# Altium schematic sheet Sheet6.SchDoc
size B
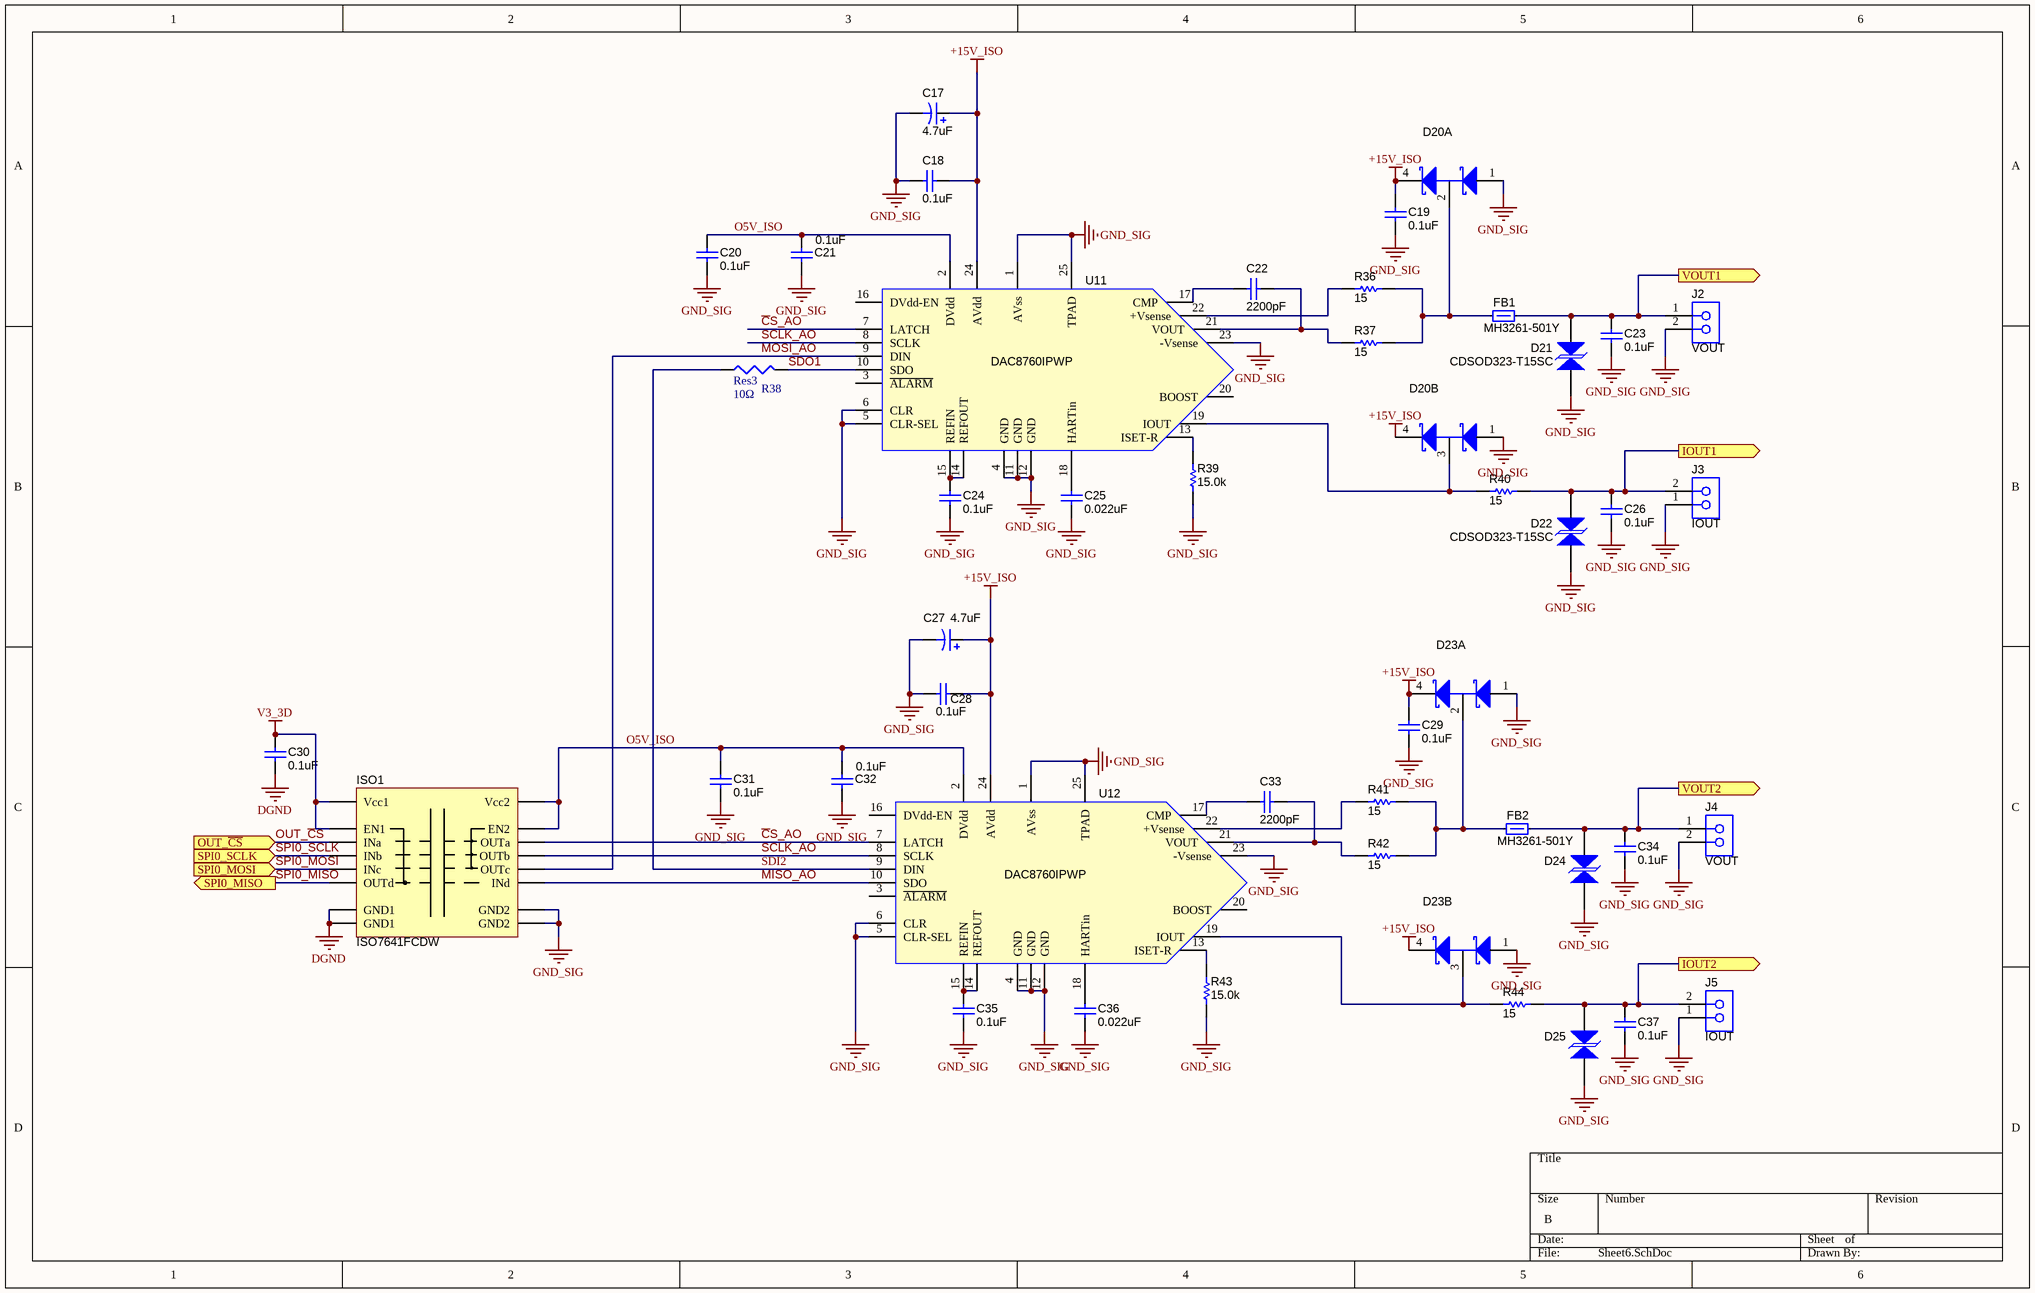
[diagram p0: Sheet6.SchDoc]

## Parts
C17  ValueDisplayed: 4.7uF  [6032-28]  (hidden comment: 293D475X9035C2TE3)
C18  ValueDisplayed: 0.1uF  [0805_cap]  (hidden comment: GRM188R71H104KA93D)
C19  ValueDisplayed: 0.1uF  [0805_cap]  (hidden comment: GRM188R71H104KA93D)
C20  ValueDisplayed: 0.1uF  [0805_cap]  (hidden comment: GRM188R71H104KA93D)
C21  ValueDisplayed: 0.1uF  [0805_cap]  (hidden comment: GRM188R71H104KA93D)
C22  ValueDisplayed: 2200pF  [0805_cap]  (hidden comment: GRM1885C1H222JA01D)
C23  ValueDisplayed: 0.1uF  [0805_cap]  (hidden comment: 06035C104KAT2A)
C24  ValueDisplayed: 0.1uF  [0805_cap]  (hidden comment: 06035C104KAT2A)
C25  ValueDisplayed: 0.022uF  [0805_cap]  (hidden comment: C1608X7R1H223K)
C26  ValueDisplayed: 0.1uF  [0805_cap]  (hidden comment: 06035C104KAT2A)
C27  ValueDisplayed: 4.7uF  [6032-28]  (hidden comment: 293D475X9035C2TE3)
C28  ValueDisplayed: 0.1uF  [0805_cap]  (hidden comment: GRM188R71H104KA93D)
C29  ValueDisplayed: 0.1uF  [0805_cap]  (hidden comment: GRM188R71H104KA93D)
C30  ValueDisplayed: 0.1uF  [0805_cap]  (hidden comment: GRM188R71H104KA93D)
C31  ValueDisplayed: 0.1uF  [0805_cap]  (hidden comment: GRM188R71H104KA93D)
C32  ValueDisplayed: 0.1uF  [0805_cap]  (hidden comment: GRM188R71H104KA93D)
C33  ValueDisplayed: 2200pF  [0805_cap]  (hidden comment: GRM1885C1H222JA01D)
C34  ValueDisplayed: 0.1uF  [0805_cap]  (hidden comment: 06035C104KAT2A)
C35  ValueDisplayed: 0.1uF  [0805_cap]  (hidden comment: 06035C104KAT2A)
C36  ValueDisplayed: 0.022uF  [0805_cap]  (hidden comment: C1608X7R1H223K)
C37  ValueDisplayed: 0.1uF  [0805_cap]  (hidden comment: 06035C104KAT2A)
D20  (no value)  [SOT-143]  (parts A,B of 2)
D21  CDSOD323-T15SC  [sod-323]
D22  CDSOD323-T15SC  [sod-323]
D23  (no value)  [SOT-143]  (parts A,B of 2)
D24  (no value)  [sod-323]
D25  (no value)  [sod-323]
FB1  MH3261-501Y  [1210]
FB2  MH3261-501Y  [1210]
ISO1  ISO7641FCDW  [M16B_N]
J2  VOUT  [ED555/2DS]
J3  IOUT  [ED555/2DS]
J4  VOUT  [ED555/2DS]
J5  IOUT  [ED555/2DS]
R36  value 15  [0805]  (hidden comment: CRCW060315R0JNEA)
R37  value 15  [0805]  (hidden comment: CRCW060315R0JNEA)
R38  Res3  value 10Ω  [0805]
R39  value 15.0k  [0805]  (hidden comment: RT0603BRD0715KL)
R40  value 15  [1210]  (hidden comment: RPC2512JT15R0)
R41  value 15  [0805]  (hidden comment: CRCW060315R0JNEA)
R42  value 15  [0805]  (hidden comment: CRCW060315R0JNEA)
R43  value 15.0k  [0805]  (hidden comment: RT0603BRD0715KL)
R44  value 15  [1210]  (hidden comment: RPC2512JT15R0)
U11  DAC8760IPWP  [PWP24-DIE84X166]
U12  DAC8760IPWP  [PWP24-DIE84X166]

## Ports
IOUT1 (out), IOUT2 (out), OUT_~{CS} (in), SPI0_MISO (out), SPI0_MOSI (in), SPI0_SCLK (in), VOUT1 (out), VOUT2 (out)

## Nets
+15V_ISO: C17.1(+) C18.1 C19.1 C27.1(+) C28.1 C29.1 D20.4 D23.4 U11.24(AVdd) U12.24(AVdd)
DGND: C30.2 ISO1.2(GND1) ISO1.8(GND1)
GND_SIG: C17.2(-) C18.2 C19.2 C20.2 C21.2 C23.2 C24.2 C25.2 C26.2 C27.2(-) C28.2 C29.2 C31.2 C32.2 C34.2 C35.2 C36.2 C37.2 D20.1 D21.2 D22.2 D23.1 D24.2 D25.2 ISO1.9(GND2) ISO1.15(GND2) J2.2 J3.1 J4.2 J5.1 R39.1 R43.1 U11.1(AVss) U11.4(GND) U11.5(CLR-SEL) U11.6(CLR) U11.11(GND) U11.12(GND) U11.23(-Vsense) U11.25(TPAD) U12.1(AVss) U12.4(GND) U12.5(CLR-SEL) U12.6(CLR) U12.11(GND) U12.12(GND) U12.23(-Vsense) U12.25(TPAD)
V3_3D: C30.1 ISO1.1(Vcc1) ISO1.7(EN1)
~{C}S_AO: ISO1.14(OUTa) U11.7(LATCH) U12.7(LATCH)
IOUT1: C26.1 D22.1 J3.2 R40.2 ; port IOUT1
IOUT2: C37.1 D25.1 J5.2 R44.2 ; port IOUT2
MISO_AO: ISO1.11(INd) U12.10(SDO)
MOSI_AO: ISO1.12(OUTc) U11.9(DIN)
O5V_ISO: C20.1 C21.1 C31.1 C32.1 ISO1.10(EN2) ISO1.16(Vcc2) U11.2(DVdd) U12.2(DVdd)
OUT_~{CS}: ISO1.3(INa) ; port OUT_~{CS}
SCLK_AO: ISO1.13(OUTb) U11.8(SCLK) U12.8(SCLK)
SDI2: R38.1 U12.9(DIN)
SDO1: R38.2 U11.10(SDO)
SPI0_MISO: ISO1.6(OUTd) ; port SPI0_MISO
SPI0_MOSI: ISO1.5(INc) ; port SPI0_MOSI
SPI0_SCLK: ISO1.4(INb) ; port SPI0_SCLK
VOUT1: C23.1 D21.1 FB1.2 J2.1 ; port VOUT1
VOUT2: C34.1 D24.1 FB2.2 J4.1 ; port VOUT2
NetC22_1: C22.1 R37.1 U11.21(VOUT)
NetC22_2: C22.2 U11.17(CMP)
NetC24_1: C24.1 U11.14(REFOUT) U11.15(REFIN)
NetC25_1: C25.1 U11.18(HARTin)
NetC33_1: C33.1 R42.1 U12.21(VOUT)
NetC33_2: C33.2 U12.17(CMP)
NetC35_1: C35.1 U12.14(REFOUT) U12.15(REFIN)
NetC36_1: C36.1 U12.18(HARTin)
NetD20_2: D20.2 FB1.1 R36.2 R37.2
NetD20_3: D20.3 R40.1 U11.19(IOUT)
NetD23_2: D23.2 FB2.1 R41.2 R42.2
NetD23_3: D23.3 R44.1 U12.19(IOUT)
NetR36_1: R36.1 U11.22(+Vsense)
NetR39_2: R39.2 U11.13(ISET-R)
NetR41_1: R41.1 U12.22(+Vsense)
NetR43_2: R43.2 U12.13(ISET-R)

Not connected (* = marked no-connect by the designer): U11 3(~{ALARM}) 16(DVdd-EN) 20(BOOST); U12 3(~{ALARM}) 16(DVdd-EN) 20(BOOST)

## Library data of the parts
C17 C27 = 293D475X9035C2TE3: CAP, TA, 4.7uF, 35V, +/-10%, 1.9 ohm, SMD; Manufacturer: Vishay-Sprague; Polarized: Y; CompType: Capacitor; U/M: EA; Cap_F: 0.0000047; Tolerance_%: 10; Value1: 1.9 ohm; VDC_V: 35; ESR_Ohm: 1.9; IRMS_A: 0.24; TaMin_C: -55; TaMax_C: 125; Cap_Case: C; SymbolVersion: 2008-07-09; Value: 4.7uF; PartNumber: 293D475X9035C2TE3; PackageReference: 6032-28; RoHS: Y; Value2: 35V; MountType: SMT; Technology: TA; Series: 293D; Publisher: Texas Instruments; LatestRevisionDate: 2013-11-07; LatestRevisionNote: Updated supplier links; ComponentLink1Description: Datasheet link; ComponentLink1URL: http://www.vishay.com/docs/40002/293d.pdf; Supplier 1: Digi-Key; Supplier Part Number 1: 718-1083-1-ND; Supplier 2: Mouser; Supplier Part Number 2: 74-293D475X9035C2TE3; Supplier 3: Farnell; Supplier Part Number 3: 1612257
C18-C21 C28-C32 = GRM188R71H104KA93D: CAP, CERM, 0.1uF, 50V, +/-10%, X7R, 0603; Manufacturer: MuRata; Polarized: N; CompType: Capacitor; U/M: EA; Cap_F: 0.0000001; Tolerance_%: 10; VDC_V: 50; TaMin_C: -55; TaMax_C: 125; Cap_Case: 0603; SymbolVersion: 2008-07-09; Value: 0.1uF; PartNumber: GRM188R71H104KA93D; PackageReference: 0603; RoHS: Y; Value1: ?; Value2: 50V; MountType: SMT; Technology: Ceramic; TempCo: X7R; Published: 2008-06-19; Publisher: Texas Instruments; LatestRevisionDate: 2012-04-11; LatestRevisionNote: Changed publisher; ComponentLink1Description: Datasheet link; ComponentLink1URL: http://search.murata.co.jp/Ceramy/PnsearchViewAction.do?HnOFG=ON&HnNFG=ON&SEL_CNT=50&sLang=en&sKey=GRM188R71H104KA93D&x=9&y=9&search=startwith; Alternate PartNumber: -; Alternate Manufacturer: -; Supplier 1: Digi-Key; Supplier Part Number 1: 490-1519-1-ND; Supplier 2: Farnell; Supplier Part Number 2: 1118182; Supplier 3: Arrow; Supplier Part Number 3: GRM188R71H104KA93D
C22 C33 = GRM1885C1H222JA01D: CAP, CERM, 2200pF, 50V, +/-5%, C0G/NP0, 0603; Manufacturer: MuRata; Polarized: N; CompType: Capacitor; U/M: EA; Cap_F: 0.0000000022; Tolerance_%: 5; Value1: Unknown; VDC_V: 50; TaMin_C: -55; TaMax_C: 125; Cap_Case: 0603; SymbolVersion: 2008-07-09; Value: 2200pF; PartNumber: GRM1885C1H222JA01D; PackageReference: 0603; RoHS: Y; Value2: 50V; MountType: SMT; Technology: Ceramic; TempCo: C0G/NP0; Published: 2008-06-19; Publisher: Texas Instruments; LatestRevisionDate: 2013-05-24; LatestRevisionNote: Changed publisher; ComponentLink1Description: Datasheet link; ComponentLink1URL: http://search.murata.co.jp/Ceramy/PnsearchViewAction.do?HnOFG=ON&HnNFG=ON&SEL_CNT=50&sLang=en&sKey=GRM1885C1H222JA01D&x=9&y=9&search=startwith; Supplier 1: Digi-Key; Supplier Part Number 1: 490-1459-1-ND; Supplier 2: Mouser; Supplier Part Number 2: 81-GRM1885C1H222JA01; Supplier 3: Farnell; Supplier Part Number 3: 8819947
C23 C24 C26 C34 C35 C37 = 06035C104KAT2A: CAP, CERM, 0.1uF, 50V, +/-10%, X7R, 0603; Manufacturer: AVX; Polarized: N; CompType: Capacitor; U/M: EA; Cap_F: 0.0000001; Tolerance_%: 10; Value1: Unknown; VDC_V: 50; TaMin_C: -55; TaMax_C: 125; Cap_Case: 0603; SymbolVersion: 2008-07-09; Value: 0.1uF; PartNumber: 06035C104KAT2A; PackageReference: 0603; RoHS: Y; Value2: 50V; MountType: SMT; Technology: Ceramic; TempCo: X7R; Published: 2008-06-19; Publisher: Texas Instruments; LatestRevisionDate: 2013-05-24; LatestRevisionNote: Changed publisher; ComponentLink1Description: Datasheet link; ComponentLink1URL: http://www.avx.com/docs/Catalogs/cx7r.pdf; Supplier 1: Digi-Key; Supplier Part Number 1: 478-5052-1-ND; Supplier 2: Mouser; Supplier Part Number 2: 581-06035C104KAT2A; Supplier 3: Farnell; Supplier Part Number 3: 1301804
C25 C36 = C1608X7R1H223K: CAP, CERM, 0.022uF, 50V, +/-10%, X7R, 0603; Manufacturer: TDK; Polarized: N; CompType: Capacitor; U/M: EA; Cap_F: 0.000000022; Tolerance_%: 10; ESR_Ohm: 0.0383; Value1: 0.0383 ohm; VDC_V: 50; TaMin_C: -55; TaMax_C: 125; Cap_Case: 0603; SymbolVersion: 2008-07-09; Value: 0.022uF; PartNumber: C1608X7R1H223K; PackageReference: 0603; RoHS: Y; Value2: 50V; MountType: SMT; Technology: Ceramic; TempCo: X7R; Published: 2008-06-19; Publisher: Texas Instruments; LatestRevisionDate: 2013-05-24; LatestRevisionNote: Changed publisher; ComponentLink1Description: Datasheet link; ComponentLink1URL: http://www.tdk.co.jp/tefe02/e412_c.pdf; Supplier 1: Digi-Key; Supplier Part Number 1: 445-1312-1-ND; Supplier 2: Farnell; Supplier Part Number 2: 1907316
D20 D23 = CD143A-SR70: IC TVS ARRAY 2-LINE 70V SOT-143; Manufacturer: Bourns; SymbolVersion: use current date i.e. 2008-05-20; SymbolCreator: Use LDAP id; U/M: EA, IN, or GM; MountType: SMT; RoHS: y; PartNumber: CD143A-SR70; PackageReference: TO-253-4; ComponentLink1Description: Datasheet Link; ComponentLink1URL: http://www.digikey.com/product-detail/en/CD143A-SR70/CD143A-SR70CT-ND/1630599; CompType: TVS; Alternate PartNumber: -; Alternate Manufacturer: -; Supplier Part Number 1: CD143A-SR70CT-ND
D21 D22 = SMAJ15CA: DIODE TVS ARRAY 15V SOD323; Manufacturer: Bourns; SymbolVersion: use current date i.e. 2008-05-20; SymbolCreator: Use LDAP id; U/M: EA, IN, or GM; MountType: SMT; RoHS: Y; PartNumber: CDSOD323-T15SC; PackageReference: SMA; ComponentLink1Description: Datasheet Link; CompType: TVS; Alternate PartNumber: -; Alternate Manufacturer: -; Supplier Part Number 1: CDSOD323-T15SCCT-ND; Supplier 1: Digi-Key
D24 D25 = SMAJ15CA: DIODE TVS ARRAY 15V SOD323; Manufacturer: Bourns; PartNumber: CDSOD323-T15SC; SymbolVersion: use current date i.e. 2008-05-20; SymbolCreator: Use LDAP id; U/M: EA, IN, or GM; MountType: SMT; RoHS: Y; PackageReference: SMA; ComponentLink1Description: Datasheet Link; CompType: TVS; Alternate PartNumber: -; Alternate Manufacturer: -; Supplier Part Number 1: CDSOD323-T15SCCT-ND; Supplier 1: Digi-Key
FB1 FB2 = Ferrite_Bead: BEAD FERRITE 500 OHM 3.0A 3216; Manufacturer: Bourns Inc.; CompType: Resistor; U/M: EA; SymbolVersion: 2009-06-02; PackageReference: 1812; PartNumber: MH3261-501Y; RoHS: Y; MountType: SMT; Publisher: Texas Instruments; Alternate Manufacturer: -; Alternate PartNumber: -; Supplier1: Digi-Key; Supplier Part Number 1: MH3261-501YCT-ND
ISO1 = ISO7241: ISOLATOR DGTL 25MBPS 4CH 16SOIC; Manufacturer: Texas Instruments Inc; SymbolVersion: use current date i.e. 2008-05-20; SymbolCreator: Use LDAP id; CompType: Used in some BOM reports.  Useful for finding later.; U/M: EA, IN, or GM; MountType: SMT; RoHS: Y; PartNumber: ISO7641FCDW; PackageReference: SOIC-16; ComponentLink1Description: http://www.ti.com/lit/ds/symlink/iso7241c.pdf; Alternate PartNumber: -; Alternate Manufacturer: -; Supplier Part Number 1: ISO7641FCDW-ND
J2-J5 = 1727010: TERMINAL BLOCK 3.5MM 2POS PCB; Manufacturer: On Shore Technology Inc; U/M: EA; Value: 2x1; SymbolVersion: 2010-10-20; PartNumber: ED555/2DS; CompType: Terminal Block; RoHS: Y; MountType: TH; ComponentLink1Description: Datasheet Link; Publisher: Texas Instruments; LatestRevisionDate: 2012-05-17; LatestRevisionNote: Changed publisher; Alternate Manufacturer: -; Alternate PartNumber: -; Supplier 1: Digi-Key; Supplier Part Number 1: ED1514-ND
  J2 J4: ComponentLink1URL: http://eshop.phoenixcontact.com/phoenix/pdf.do?UID=1727010&general=usen
R36 R37 R41 R42 = CRCW060315R0JNEA: RES, 15 ohm, 5%, 0.1W, 0603; Manufacturer: Vishay-Dale; CompType: Resistor; Value_Code: 15R0; Tolerance_%: 5; Power_W: 0.1; VDC_V: 75; TempCo: 200 ppm/C; EIA_Code: E24; U/M: EA; SymbolVersion: 2009-05-29; PartNumber: CRCW060315R0JNEA; PackageReference: 0603; RoHS: Y; Res_ohm: 15; Value1: 5%; Value2: 0.1W; MountType: SMT; Technology: Thick Film; Published: 2008-06-26; Publisher: Texas Instruments; LatestRevisionDate: 2013-01-08; ComponentLink1Description: Datasheet link; ComponentLink1URL: http://www.vishay.com/docs/20035/dcrcwe3.pdf; Supplier 1: Digi-Key; Supplier Part Number 1: 541-15GCT-ND; Supplier 2: Mouser; Supplier Part Number 2: 71-CRCW0603J-15-E3; Supplier 3: Farnell; Supplier Part Number 3: 1514720
R38 = Res3: Resistor; Published: 8-Jun-2000; LatestRevisionDate: 29-May-2009; LatestRevisionNote: IPC-7351 Footprint Added.; PackageReference: J1-0603; Publisher: Altium Limited; PackageDescription: Chip Resistor
R39 R43 = RT0603BRD0715KL: RES, 15.0k ohm, 0.1%, 0.1W, 0603; Manufacturer: Yageo America; CompType: Resistor; Res_ohm: 15000; Value_Code: 15k0; Tolerance_%: 0.1; VDC_V: 75; TempCo: 25 ppm/C; EIA_Code: E192; U/M: EA; SymbolVersion: 2009-05-29; PartNumber: RT0603BRD0715KL; PackageReference: 0603; RoHS: Y; Value1: 0.1%; Power_W: 0.1; Value2: 0.1W; MountType: SMT; Technology: Thin Film; Published: 2008-06-26; Publisher: Texas Instruments; LatestRevisionDate: 2012-04-20; LatestRevisionNote: Changed publisher; ComponentLink1Description: Datasheet link; ComponentLink1URL: http://www.yageo.com/pdf/PYu-RT_1-to-0.05_RoHS_L_3.pdf; Alternate PartNumber: -; Alternate Manufacturer: -; Supplier Part Number 1: RT0603BRD0715KL-ND
R40 R44 = CRA2512-FZ-R080ELF: RES 15 OHM 1W 5% 2512; Manufacturer: Stackpole Electronics; CompType: Resistor; Value_Code: 15R; Tolerance_%: 5; Power_W: 3; VDC_V: 0; U/M: EA; SymbolVersion: 2009-05-29; PartNumber: RPC2512JT15R0; PackageReference: 2512; RoHS: Y; Res_ohm: 15; Value1: 5%; Value2: 1W; MountType: SMT; Technology: Metal Film; LatestRevisionDate: 2012-04-20; LatestRevisionNote: Changed publisher; ComponentLink1Description: Datasheet link; Alternate PartNumber: -; Alternate Manufacturer: -; Supplier 1: Digi-Key; Supplier Part Number 1: RPC2512JT15R0CT-ND
U11 U12 = DAC8760IPWP_1: 1-Channel, 16-Bit, Programmable Current/Voltage Output DAC for 4-20mA Current Loop Applications; Manufacturer: Texas Instruments; CompType: IC; SymbolCreator: x0120606; ComponentLink1URL: http://www.ti.com/lit/gpn/dac8760; PartNumber: DAC8760IPWP; Alternate Manufacturer: *; Alternate PartNumber: *; PackageReference: HTSSOP (PWP) 24; MountType: SMT; Publisher: Texas Instruments; RoHS: Y; ComponentLink1Description: Datasheet link